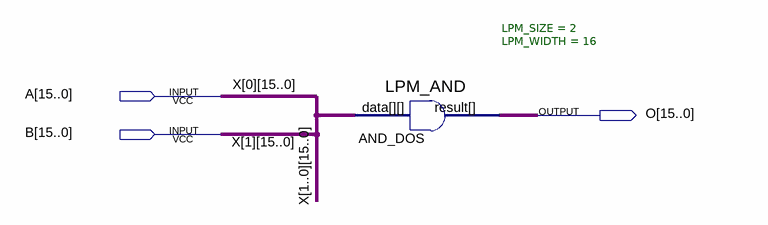
[diagram p0: schematic sheet]
// Quartus schematic aandb.bdf as structural Verilog: 1 symbols, 3 pins
module aandb (
  input  [15:0] A,
  input  [15:0] B,
  output [15:0] O
);

  LPM_AND #(.LPM_SIZE(2), .LPM_WIDTH(16)) AND_DOS (.data({B, A}), .result(O));

  // Other names for the same wires on the sheet: X_0[15:0] = A; X_1[15:0] = B
endmodule
